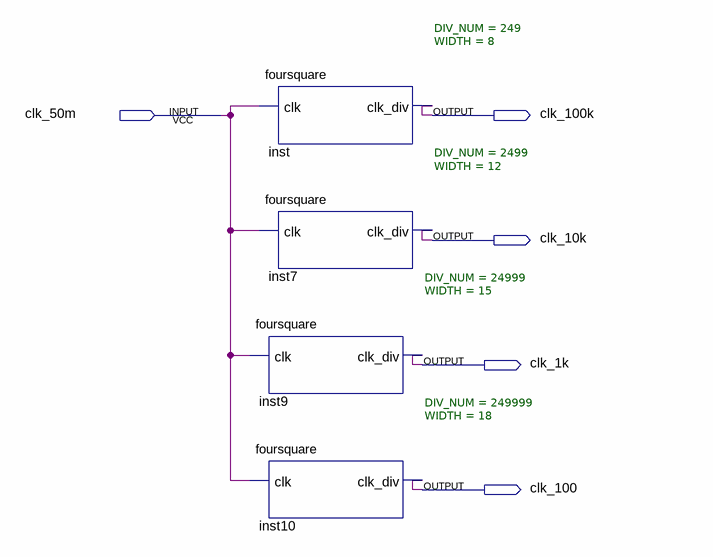
[diagram p0: schematic sheet]
// Quartus schematic Block2.bdf as structural Verilog: 4 symbols, 5 pins
module Block2 (
  input  clk_50m,
  output clk_100k,
  output clk_10k,
  output clk_1k,
  output clk_100
);

  foursquare #(.DIV_NUM(249), .WIDTH(8)) inst (.clk(clk_50m), .clk_div(clk_100k));
  foursquare #(.DIV_NUM(2499), .WIDTH(12)) inst7 (.clk(clk_50m), .clk_div(clk_10k));
  foursquare #(.DIV_NUM(24999), .WIDTH(15)) inst9 (.clk(clk_50m), .clk_div(clk_1k));
  foursquare #(.DIV_NUM(249999), .WIDTH(18)) inst10 (.clk(clk_50m), .clk_div(clk_100));
endmodule
